# EasyEDA Pro project USB-TTL.eprj

# Schematic Schematic1
Board Name: Board1; Create Date: 2025-11-21; Page Name: P1; Project Name: USB-TTL; Schematic Name: Schematic1; Update Date: 2025-11-21; Company: 嘉立创EDA; Page Size: A4; Version: V1.0
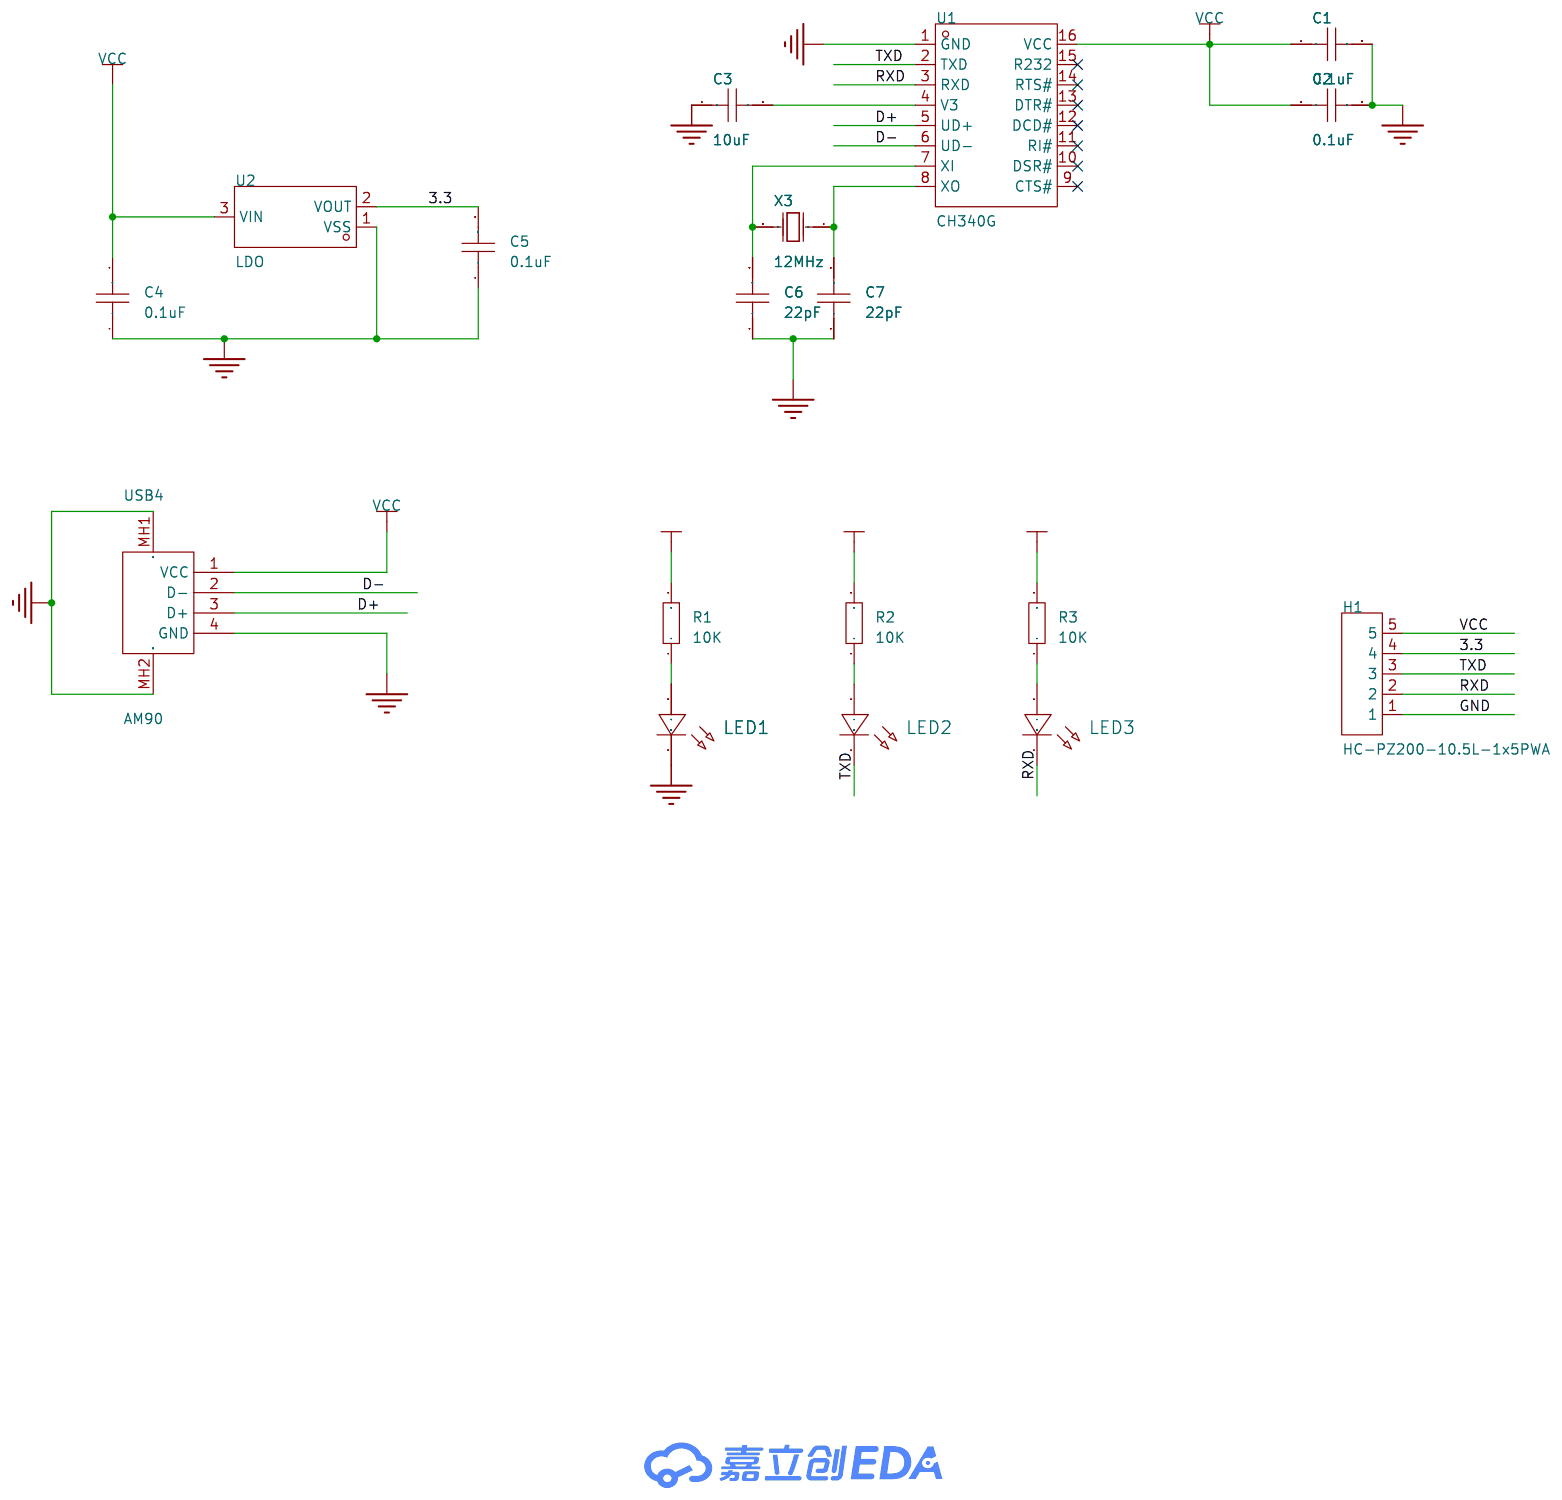
[diagram p0: schematic sheet]

## Parts
C1  0.1uF  [C0603]
C2  0.1uF  [C0603]
C3  10uF  [C0603]
C4  0.1uF  [C0603]
C5  0.1uF  [C0603]
C6  22pF  [C0603]
C7  22pF  [C0603]
H1  HC-PZ200-10.5L-1x5PWA  [HDR-TH_5P-P2.00-H-M_2005WR-5P]
LED1  -  [LED_0603]
LED2  -  [LED_0603]
LED3  -  [LED_0603]
R1  10K  [R0603]
R2  10K  [R0603]
R3  10K  [R0603]
U1  CH340G  [SOIC-16_L9.9-W3.9-P1.27-LS6.0-BL]
U2  LDO  [SOT-23-3_L3.0-W1.7-P0.95-LS2.9-BR]
USB4  AM90  [USB-AM-TH_AM90]
X3  12MHz  [HC-49S_L11.4-W4.8]

## Library data of the parts
C1-C7 = CAP_0603: Supplier Footprint: 0603
H1 = HC-PZ200-10.5L-1x5PWA: LCSC Part Name: 1x5P 间距:2mm 方针 弯插; Supplier Part: C22373834; Manufacturer: HC(虹成电子); Supplier Footprint: 弯插,P=2mm; JLCPCB Part Class: 扩展库; Datasheet: https://item.szlcsc.com/datasheet/HC-PZ200-10.5L-1x5PWA/23870170.html; Supplier: LCSC; Pin Structure: 1x5P; Pitch: 2mm; Circluar Pins/Square Pins: 方针; Mounting Type: 弯插; Number of Rows: 单排; Number of Pins: 5P; Current Rating: 1.5A; Length of Mating Pin: 4mm; Insulation Height: 2mm; Length of End Connection Pin: 2.8mm; Contact Material: 黄铜; Contact Plating: 金; Operating Temperature: -40℃~+105℃; Color: 黑色
LED1-LED3 = LED_0603-R: Supplier Footprint: 0603
R1-R3 = Res_0603: Supplier Footprint: 0603
U1 = CH340G: LCSC Part Name: USB转串口芯片CH340; Supplier Part: C14267; Manufacturer: WCH(南京沁恒); Supplier Footprint: SOP-16; JLCPCB Part Class: 扩展库; Datasheet: https://atta.szlcsc.com/upload/public/pdf/source/20240313/8510303D24D987FBF1AD30058571F10E.pdf; Supplier: LCSC; Applications Function: USB转UART; Protocol: USB 2.0; Supply Voltage: 5V；3.3V; Data Rate: 2Mbps; Operating Temperature: -40℃~+85℃
U2 = XC6206P332MR_C347376: LCSC Part Name: 高纹波抑制率、低功耗、低压差 CMOS 降压型电压稳压器; Supplier Part: C347376; Manufacturer: UMW(友台半导体); Manufacturer Part: XC6206P332MR; Supplier Footprint: SOT-23; JLCPCB Part Class: 扩展库; Datasheet: https://item.szlcsc.com/datasheet/XC6206P332MR/324036.html; Supplier: LCSC; Output Type: 固定; Voltage - Supply: 8V; Output Voltage: 3.3V; Output Current: 250mA; Power Supply Rejection Ratio (PSRR): 40dB@(1kHz); Voltage Dropout: 240mV@(50mA); standby current: 7uA; Features: 过流保护；短路保护; Operating Temperature: -25℃~+80℃@(Ta); Output Configuration: 正极; Number of Outputs: 1
USB4 = AM90: LCSC Part Name: Type-A 公 弯插; Supplier Part: C404965; Manufacturer: SHOU HAN(首韩); Supplier Footprint: 插件; JLCPCB Part Class: 扩展库; Datasheet: https://atta.szlcsc.com/upload/public/pdf/source/20190722/C404965_9CC10BE28E3F9E5134758D030387C529.pdf; Supplier: LCSC; Connector Type: Type-A; Standard: USB 2.0; Gender: 公; Mounting Style: 弯插; Number of Contacts: 4P; Number of Ports: 1; Current Rating - Power (Max): 1.5A; Rated Voltage (Max): 30V; Connect-Disconnect Life: 5千次; Length: 18.8mm; Core Colour: 白色; Operating Temperature Range: -25℃~+85℃
X3 = X49SM12MSD2SC: LCSC Part Name: HC-49SMD 12MHZ 2P 49SMD 20PF ±20PPM -20~70℃（±30PPM）; Supplier Part: C14871; Manufacturer: YXC(扬兴晶振); Supplier Footprint: HC-49S-SMD; JLCPCB Part Class: 扩展库; Datasheet: https://item.szlcsc.com/datasheet/X49SM12MSD2SC/15543.html; Supplier: LCSC; Type: 贴片晶振; Normal temperature Frequency Tolerance: ±20ppm; Load Capacitance: 20pF; Frequency Stability: ±30ppm; Operating Temperature: -20℃~+70℃

## Nets
GND: C1.2 C2.2 C3.1 C4.1 C5.1 C6.1 C7.1 H1.1 LED1.1(C) U1.1(GND) U2.1(VSS) USB4.4(GND) USB4.MH1 USB4.MH2
VCC: C1.1 C2.1 C4.2 H1.5 U1.16(VCC) U2.3(VIN) USB4.1(VCC)
3.3: C5.2 H1.4 R1.2 R2.2 R3.2 U2.2(VOUT)
D+: U1.5(UD+) USB4.3(D+)
D-: U1.6(UD-) USB4.2(D-)
RXD: H1.2 LED3.1(C) U1.3(RXD)
TXD: H1.3 LED2.1(C) U1.2(TXD)
$1N1454: C3.2 U1.4(V3)
$1N2048: C6.2 U1.7(XI) X3.2(OSC2)
$1N2110: C7.2 U1.8(XO) X3.1(OSC1)
$1N2567: LED1.2(A) R1.1
$1N2583: LED2.2(A) R2.1
$1N2588: LED3.2(A) R3.1

Not connected (* = marked no-connect by the designer): U1 9(CTS#)* 10(DSR#)* 11(RI#)* 12(DCD#)* 13(DTR#)* 14(RTS#)* 15(R232)*

# Board PCB1
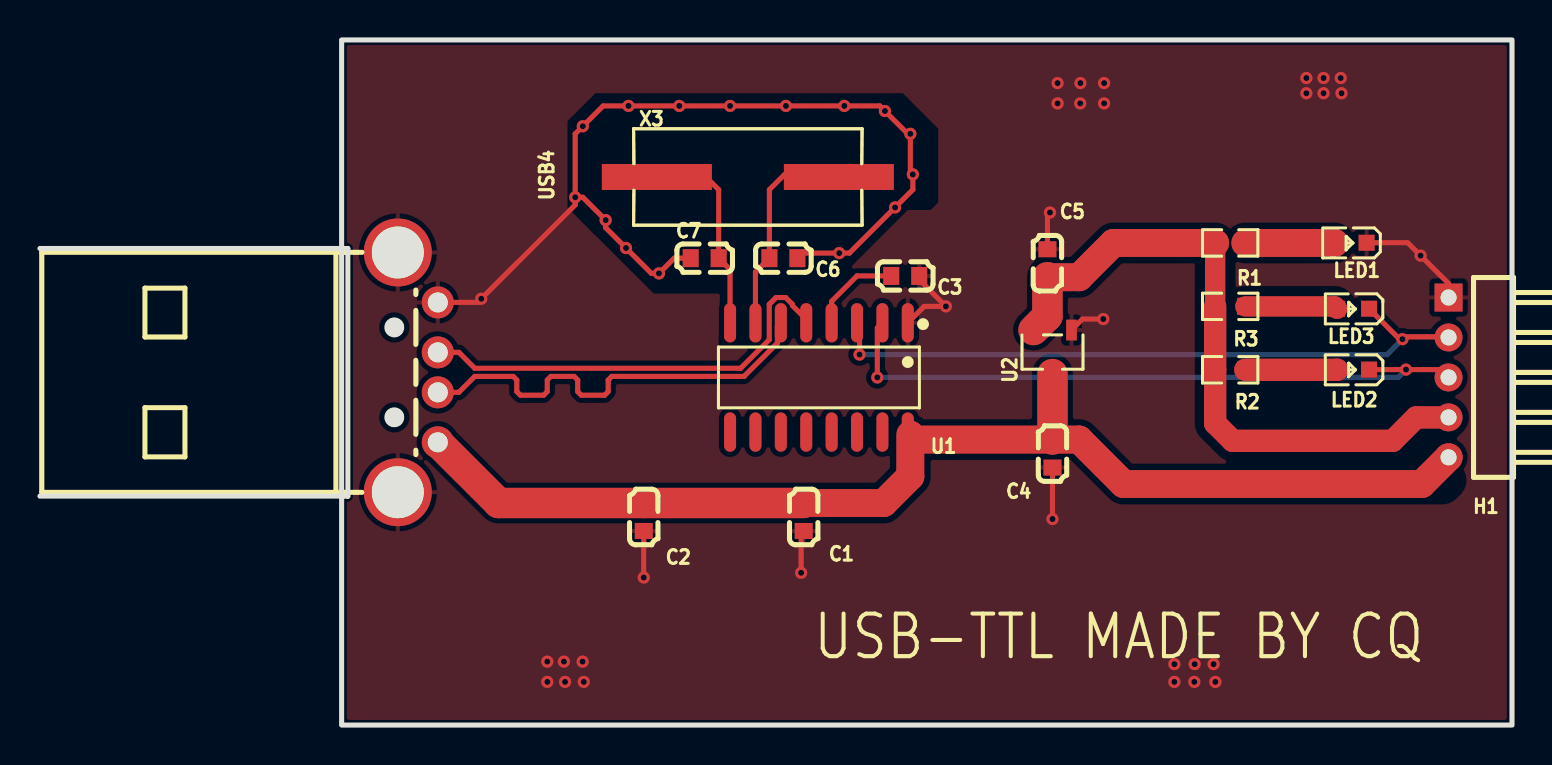
[diagram p1: board, top side]
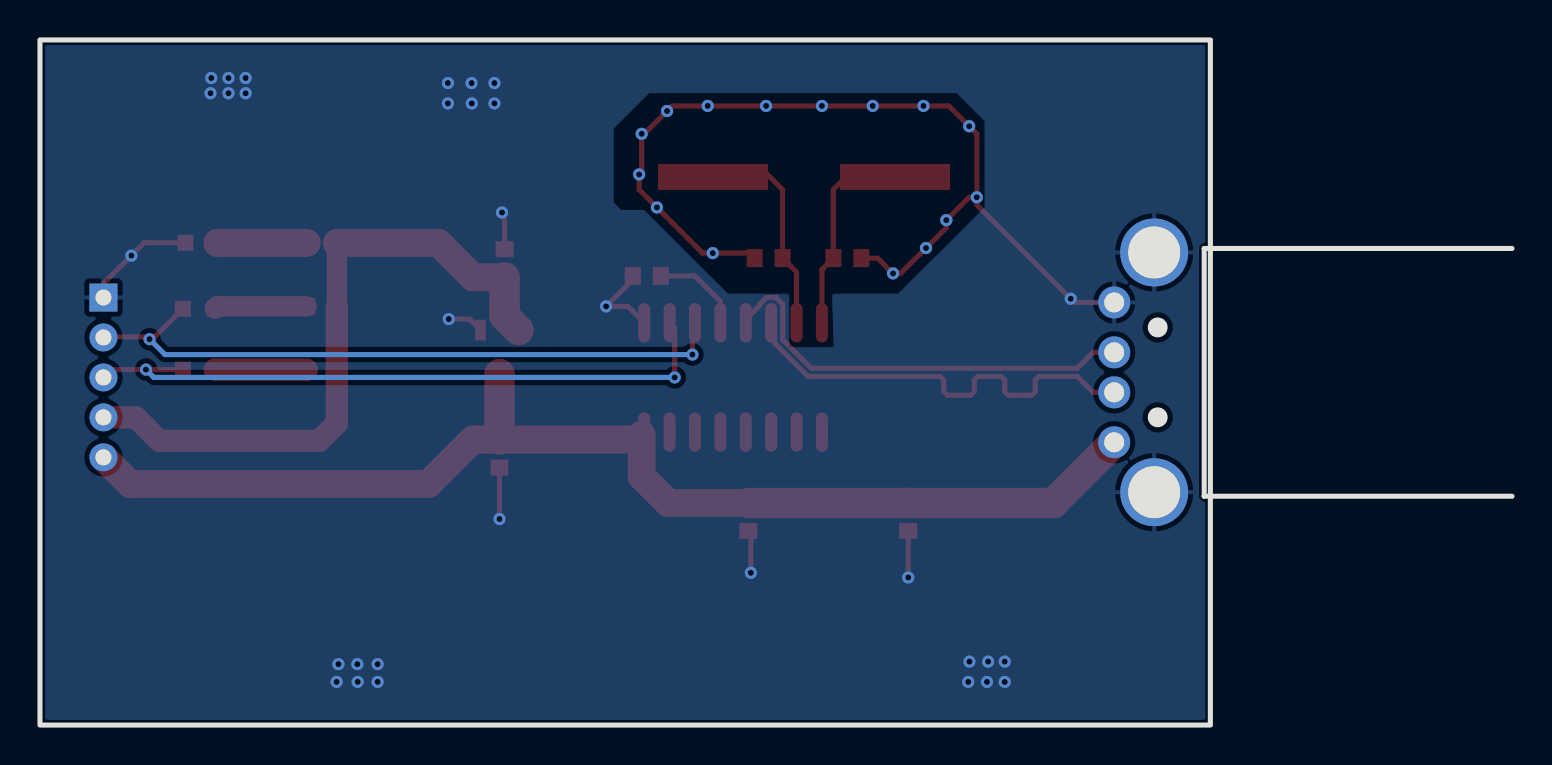
[diagram p2: board, bottom side, seen from below]

Outline 73.64 x 34.29 mm; copper layers: Top Layer, Bottom Layer. Coordinates in mm from the lower left corner of the outline.
Outline path: rectangle 15.09,34.29 73.64,0
Stack: Top Layer 0.035mm / Dielectric1 1.51mm FR4 er 4.5 / Bottom Layer 0.035mm

## Design rules (mm)
net D+: DP1
net D-: DP1
template: JLCPCB Capability(Two Layers Board)
spacing copperThickness1oz (default): track to track 0.102, other pairs 0.152 to 0.3
spacing copperThickness2oz: track to track 0.203, other pairs 0.152 to 0.3
track width copperThickness1oz (default): min 0.127, default 0.254, max 2.54
track width copperThickness2oz: min 0.203, default 0.254, max 2.54
differential pair differentialPair (default): width min 0.127, default 0.254, max 2.54; gap min 0.152, default 0.152
via viaSize (default): diameter min 0.5, default 0.61, max 10; hole min 0.3, default 0.305, max 6.3

## Placement (name value [footprint] x y rotation side)
C1  0.1uF  [C0603]  38.2 10.41 270 top
C2  0.1uF  [C0603]  30.2 10.41 270 top
C3  10uF  [C0603]  43.28 22.48 180 top
C4  0.1uF  [C0603]  50.65 13.59 90 top
C5  0.1uF  [C0603]  50.4 23.11 270 top
C6  22pF  [C0603]  37.19 23.37 180 top
C7  22pF  [C0603]  33.25 23.37 0 top
H1  HC-PZ200-10.5L-1x5PWA  [HDR-TH_5P-P2.00-H-M_2005WR-5P]  70.46 17.4 270 top
LED1  -  [LED_0603]  65.51 24.13 180 top
LED2  -  [LED_0603]  65.64 17.78 180 top
LED3  -  [LED_0603]  65.64 20.83 180 top
R1  10K  [R0603]  59.54 24.13 180 top
R2  10K  [R0603]  59.54 17.78 180 top
R3  10K  [R0603]  59.54 20.95 180 top
U1  CH340G  [SOIC-16_L9.9-W3.9-P1.27-LS6.0-BL]  38.97 17.4 180 top
U2  LDO  [SOT-23-3_L3.0-W1.7-P0.95-LS2.9-BR]  50.65 18.67 90 top
USB4  AM90  [USB-AM-TH_AM90]  18.9 17.65 270 top
X3  12MHz  [HC-49S_L11.4-W4.8]  35.41 27.43 0 top

## Footprints (pads in the part's own frame, mm; a bottom-side part is the same pattern mirrored in y, then rotated)
C0603
  rect 0.8x0.9 smd: 1(-0.7,0) 2(0.7,0)
HC-49S_L11.4-W4.8
  rect 5.5x1.3 smd: 1(-4.553,0) 2(4.553,0)
HDR-TH_5P-P2.00-H-M_2005WR-5P
  rect 1.4x1.4 hole 0.8: 1(-4,0)
  round 1.4 hole 0.8: 2(-2,0) 3(0,0) 4(2,0) 5(4,0)
LED_0603
  rect 0.8x0.8 smd: 1(-0.851,-0.01) 2(0.75,-0.005)
R0603
  rect 0.806x0.864 smd: 1(-0.753,0) 2(0.753,0)
SOIC-16_L9.9-W3.9-P1.27-LS6.0-BL
  oval 0.602x1.971 smd: 1(-4.445,-2.736) 2(-3.175,-2.736) 3(-1.905,-2.736) 4(-0.635,-2.736) 5(0.635,-2.736) 6(1.905,-2.736) 7(3.175,-2.736) 8(4.445,-2.736) 9(4.445,2.736) 10(3.175,2.736) 11(1.905,2.736) 12(0.635,2.736) 13(-0.635,2.736) 14(-1.905,2.736) 15(-3.175,2.736) 16(-4.445,2.736)
SOT-23-3_L3.0-W1.7-P0.95-LS2.9-BR
  rect 1.038x0.532 smd: 1(1.101,-0.95) 2(1.101,0.95) 3(-1.101,0)
USB-AM-TH_AM90
  round 1.6 hole 1: 1(3.5,1) 2(1,1) 3(-1,1) 4(-3.5,1)
  round 3.4 hole 2.6: MH1(6,-1) MH2(-6,-1)

## Nets
As in the schematic.

Pads without a net: U1 9 10 11 12 13 14 15

## Via types
v1: diameter 0.61, hole 0.305, Top Layer to Bottom Layer, 51 vias

## Routing (per net, layer and track width the routed paths; a pad name or vN(x,y) marks a point on that pad's centre or on a via; arc(x,y) is an arc through that point)
GND: length 69
  Top Layer w0.254: v1(38.08,7.62) 38.08,9.59 C1.2 ; C5.1 50.4,25.53 v1(50.52,25.65) ; H1.1 70.46,22.1 v1(69.06,23.5) 68.42,24.14 LED1.1 ; 43.98,22.48 43.98,22.29 v1(45.32,20.95) 44.23,20.95 U1.1 ; v1(26.77,26.42) 26.77,29.59 v1(27.16,29.97) 28.17,30.99 v1(29.44,30.99) v1(31.98,30.99) v1(34.52,30.99) v1(37.31,30.99) v1(40.24,30.99) 42.01,30.99 v1(42.27,30.73) 43.41,29.59 v1(43.54,29.59) 43.54,27.69 v1(43.66,27.56) 43.66,26.8 v1(42.78,25.91) 40.49,23.62 v1(39.98,23.62) 38.14,23.62 37.89,23.37 ; v1(26.77,26.42) 27.16,26.42 v1(28.3,25.27) 28.3,24.89 v1(29.31,23.88) 30.58,22.61 v1(30.97,22.61) 31.73,23.37 C7.1 ; v1(26.77,26.42) 26.77,26.03 v1(22.07,21.34) 21.89,21.15 USB4.4 ; U2.1 52.15,20.32 v1(53.19,20.32) ; v1(50.65,10.31) C4.1 ; v1(30.2,7.38) C2.2
  vias: v1(25.38,3.17) v1(25.38,2.16) v1(26.21,3.17) v1(26.27,2.16) v1(27.14,3.17) v1(27.2,2.16) v1(50.9,32.13) v1(50.9,31.11) v1(52.05,32.13) v1(52.04,31.11) v1(53.23,32.13) v1(53.23,31.11) v1(56.75,3.05) v1(56.75,2.16) v1(57.76,3.05) v1(57.74,2.16) v1(58.71,3.05) v1(58.8,2.16) v1(63.35,32.39) v1(63.35,31.62) v1(64.21,32.39) v1(64.21,31.62) v1(65.07,32.39) v1(65.11,31.62)
VCC: length 59.3
  Top Layer w1.016: 43.54,14.54 43.79,14.29
  Top Layer w1.397: 43.54,14.54 43.54,12.45 42.21,11.11 C1.1 ; 43.79,14.29 C4.2 51.98,14.29 54.21,12.06 69.13,12.06 H1.5
  Top Layer w1.524: USB4.1 22.94,11.11 C2.1 C1.1 ; C4.2 U2.3
3.3: length 33.6
  Top Layer w1.016: R1.2 R3.2
  Top Layer w1.117: H1.4 68.84,15.4 67.67,14.22 59.67,14.22 58.79,15.1 R2.2 R3.2
  Top Layer w1.397: R1.2 53.7,24.13 51.98,22.41 C5.2
  Top Layer w1.524: C5.2 50.4,20.47 U2.2
D+: length 21.9
  Top Layer w0.254: U1.5 38.33,20.3 37.64,20.99 37.64,21.06 37.3,21.4 36.82,21.4 36.48,21.06 36.48,19.29 35.05,17.86 21.75,17.86 20.95,18.65 USB4.3
D-: length 22
  Top Layer w0.254: USB4.2 20.95,16.65 21.75,17.45 23.67,17.45 23.85,17.27 23.85,16.69 24.03,16.51 25.2,16.51 25.38,16.69 25.38,17.27 25.56,17.45 26.72,17.45 26.9,17.27 26.9,16.69 27.08,16.51 28.24,16.51 28.42,16.69 28.42,17.27 28.6,17.45 35.22,17.45 36.89,19.12 36.89,19.96 U1.6
RXD: length 33.8
  Top Layer w0.254: H1.2 70.43,19.43 68.27,19.43 v1(68.16,19.31) 68.01,19.31 LED3.1 ; v1(41,18.54) 41,20.01 U1.3
  Bottom Layer w0.254: v1(68.16,19.31) 67.38,18.54 v1(41,18.54)
TXD: length 33.6
  Top Layer w0.254: H1.3 70.07,17.79 v1(68.33,17.79) LED2.1 ; v1(41.89,17.4) 41.89,19.88 U1.2
  Bottom Layer w0.254: v1(68.33,17.79) 67.94,17.4 v1(41.89,17.4)
$1N1454: length 4.5
  Top Layer w0.254: U1.4 39.6,21.21 40.87,22.48 42.46,22.48
$1N2048: length 10.1
  Top Layer w0.254: 39.84,27.56 37.25,27.56 36.49,26.8 C6.2 35.79,22.67 35.79,20.64
$1N2110: length 9.9
  Top Layer w0.254: 34.52,20.64 34.52,22.8 C7.2 33.95,26.8 33.19,27.56 30.73,27.56
$1N2567: length 4.5
  Top Layer w1.397: R1.1 64.75,24.13 LED1.2
$1N2583: length 4.6
  Top Layer w1.117: LED2.2 64.88,17.78 R2.1
$1N2588: length 4.6
  Top Layer w1.016: R3.1 64.76,20.95 LED3.2

## Copper pours and planes (outline as drawn; the poured copper is in the pictures)
GND on Top Layer: 13.95,36.58 76.3,36.58 76.3,-1.52 13.95,-1.52
GND on Bottom Layer: 13.95,35.81 74.4,35.81 74.4,-1.4 13.95,-1.4

## Text on the board
Top Silkscreen Layer: USB-TTL MADE BY CQ
